# EAGLE design power (EAGLE 7.7.0)
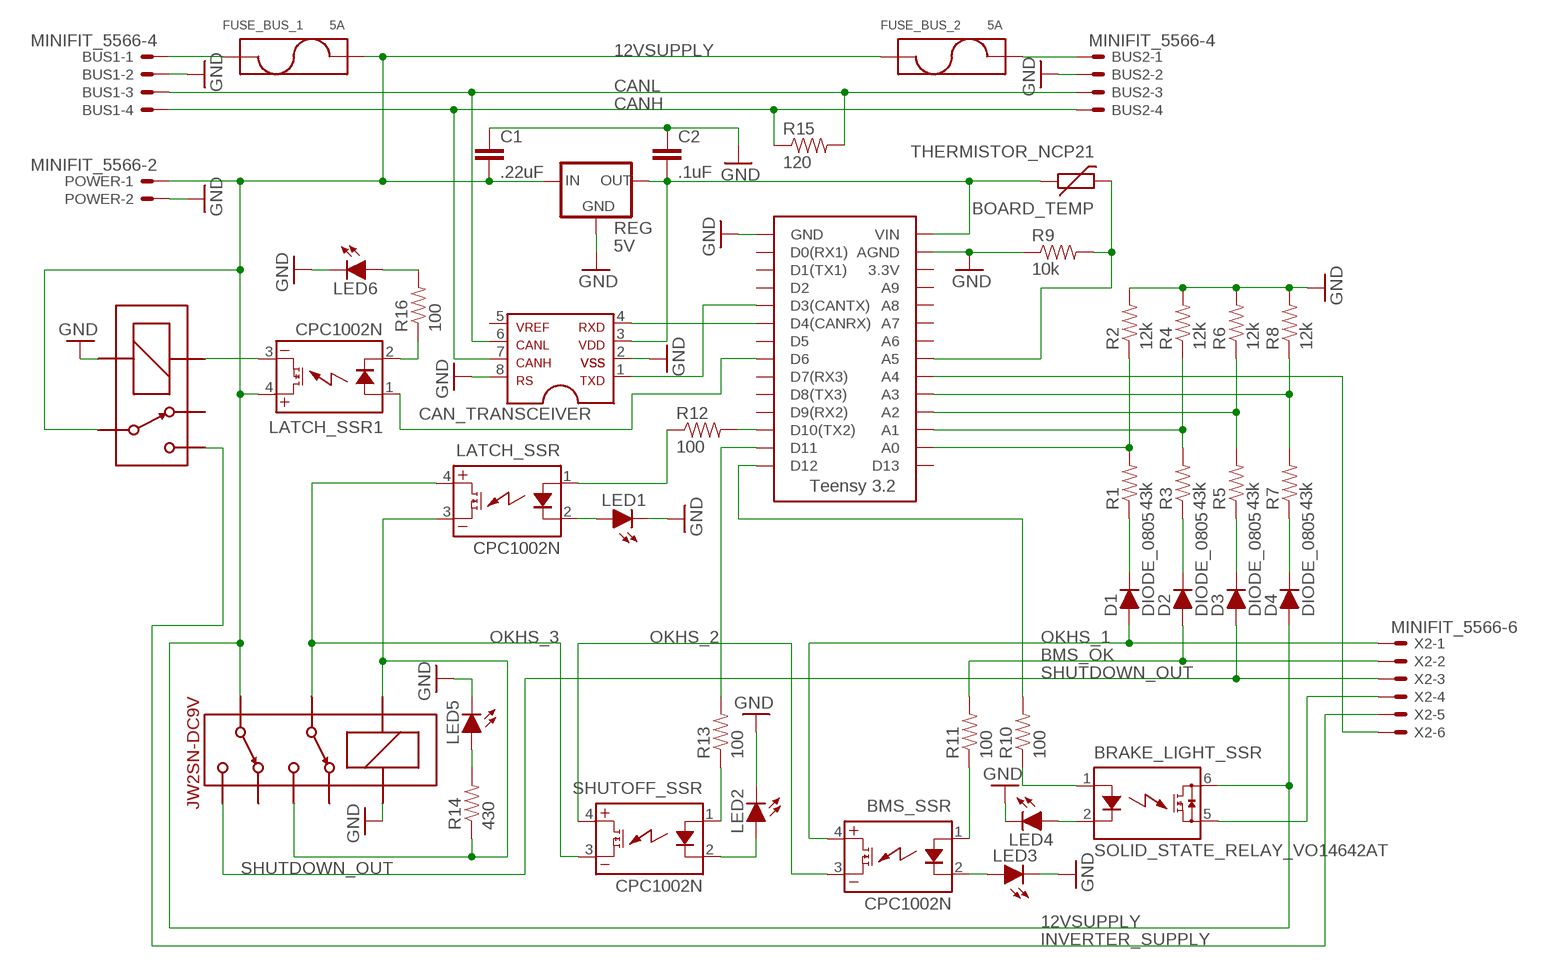
[diagram p0: schematic, sheet 1]

## Parts
BMS_SSR  CPC1002N  [SOP04]
BOARD_TEMP  THERMISTOR_NCP21  [0805]
BRAKE_LIGHT_SSR  SOLID_STATE_RELAY_VO14642AT  [DIL06]
BUS1  MINIFIT_5566-4  [MINIFIT_5566-4]
BUS2  MINIFIT_5566-4  [MINIFIT_5566-4]
C1  .22uF  CAP0805  [0805]
C2  .1uF  CAP0805  [0805]
CAN_TRANSCEIVER  MCP2551  [SOIC-08]
D1  DIODE_0805  [0805]
D2  DIODE_0805  [0805]
D3  DIODE_0805  [0805]
D4  DIODE_0805  [0805]
FUSE_BUS_1  5A  FUSE_HOLDER  [FUSE_HOLDER]
FUSE_BUS_2  5A  FUSE_HOLDER  [FUSE_HOLDER]
IMD_SHUTDOWN  DPDT_RELAY_PANASONIC_JW2SN-DC9V  [DPDT_RELAY_PANASONIC_JW2SN]
LATCH_SSR  CPC1002N  [SOP04]
LATCH_SSR1  CPC1002N  [SOP04]
LED1  LED-0805  [LED-805]
LED2  LED-0805  [LED-805]
LED3  LED-0805  [LED-805]
LED4  LED-0805  [LED-805]
LED5  LED-0805  [LED-805]
LED6  LED-0805  [LED-805]
POWER  MINIFIT_5566-2  [MINIFIT_5566-2]
R1  43k  RESISTOR0805-RES  [0805]
R2  12k  RESISTOR0805-RES  [0805]
R3  43k  RESISTOR0805-RES  [0805]
R4  12k  RESISTOR0805-RES  [0805]
R5  43k  RESISTOR0805-RES  [0805]
R6  12k  RESISTOR0805-RES  [0805]
R7  43k  RESISTOR0805-RES  [0805]
R8  12k  RESISTOR0805-RES  [0805]
R9  10k  RESISTOR0805-RES  [0805]
R10  100  RESISTOR0805-RES  [0805]
R11  100  RESISTOR0805-RES  [0805]
R12  100  RESISTOR0805-RES  [0805]
R13  100  RESISTOR0805-RES  [0805]
R14  430  RESISTOR0805-RES  [0805]
R15  120  RESISTOR0805-RES  [0805]
R16  100  RESISTOR0805-RES  [0805]
REG  5V  5V_REGULATOR_LM340-NLM340MPX-5.0/NOPB  [SOT223]
SHUTOFF_SSR  CPC1002N  [SOP04]
U$1  ORWH-SH-112D1F  [ZF112]
U$3  TEENSY_3.2_SIMPLE  [TEENSY_3.2_SIMPLE]
X2  MINIFIT_5566-6  [MINIFIT_5566-6]

## Nets
5VSUPPLY: BOARD_TEMP.1 C2.2 CAN_TRANSCEIVER.3 REG.3(OUT) U$3.VIN
12VSUPPLY: BRAKE_LIGHT_SSR.6(IO1) C1.2 D4.2(A) FUSE_BUS_1.R1 FUSE_BUS_1.R2 FUSE_BUS_2.L1 FUSE_BUS_2.L2 IMD_SHUTDOWN.6 LATCH_SSR1.4(DC+) POWER.1 REG.1(IN) U$1.P
12VSUPPLY_READ: R7.2 R8.1 U$3.A3
BMS_OK: D2.2(A) R11.2 X2.2
BMS_OK_READ: R3.2 R4.1 U$3.A1
CANH: BUS1.4 BUS2.4 CAN_TRANSCEIVER.7 R15.1
CANL: BUS1.3 BUS2.3 CAN_TRANSCEIVER.6 R15.2
GND: BUS1.2 BUS2.2 C1.1 C2.1 CAN_TRANSCEIVER.2 CAN_TRANSCEIVER.8 IMD_SHUTDOWN.COIL+ LED1.C LED2.C LED3.C LED4.C LED5.C LED6.C POWER.2 R2.2 R4.2 R6.2 R8.2 R9.1 REG.2(GND) REG.4(GND) U$1.2(COIL-) U$3.AGND U$3.GND
INVERTER_SUPPLY: U$1.S X2.5
N$1: LATCH_SSR.2(CONTROL-) LED1.A
N$2: CAN_TRANSCEIVER.4 U$3.D4(CANRX)
N$3: CAN_TRANSCEIVER.1 U$3.D3(CANTX)
N$4: BRAKE_LIGHT_SSR.5(IO2) X2.4
N$5: R12.2 U$3.D10(TX2)
N$6: IMD_SHUTDOWN.4 IMD_SHUTDOWN.COIL- LATCH_SSR.3(DC-) R14.1
N$7: BRAKE_LIGHT_SSR.2(LED-) LED4.A
N$8: LATCH_SSR.1(CONTROL+) R12.1
N$9: BMS_SSR.2(CONTROL-) LED3.A
N$10: BUS1.1 FUSE_BUS_1.L1 FUSE_BUS_1.L2
N$11: BUS2.1 FUSE_BUS_2.R1 FUSE_BUS_2.R2
N$12: R13.1 SHUTOFF_SSR.1(CONTROL+)
N$13: R10.2 U$3.D12
N$14: R13.2 U$3.D11
N$15: BOARD_TEMP.2 R9.2 U$3.A5
N$16: LED2.A SHUTOFF_SSR.2(CONTROL-)
N$17: BRAKE_LIGHT_SSR.1(LED+) R10.1
N$18: BMS_SSR.1(CONTROL+) R11.1
N$19: LED5.A R14.2
N$20: U$3.A4 X2.6
N$21: LATCH_SSR1.1(CONTROL+) U$3.D6
N$22: D1.1(C) R1.1
N$23: D2.1(C) R3.1
N$24: D3.1(C) R5.1
N$25: D4.1(C) R7.1
N$26: LATCH_SSR1.3(DC-) U$1.1(COIL+)
N$27: LATCH_SSR1.2(CONTROL-) R16.1
N$28: LED6.A R16.2
OKHS_1: BMS_SSR.4(DC+) D1.2(A) X2.1
OKHS_2: BMS_SSR.3(DC-) SHUTOFF_SSR.4(DC+)
OKHS_3: IMD_SHUTDOWN.3 LATCH_SSR.4(DC+) SHUTOFF_SSR.3(DC-)
OKHS_READ: R1.2 R2.1 U$3.A0
SHUTDOWN_OUT: D3.2(A) IMD_SHUTDOWN.5 X2.3
SHUTDOWN_OUT_READ: R5.2 R6.1 U$3.A2
Unconnected: CAN_TRANSCEIVER.5 IMD_SHUTDOWN.2 IMD_SHUTDOWN.7 U$1.O U$3.3.3V U$3.A6 U$3.A7 U$3.A8 U$3.A9 U$3.D0(RX1) U$3.D1(TX1) U$3.D2 U$3.D5 U$3.D7(RX3) U$3.D8(TX3) U$3.D9(RX2) U$3.D13

## Library data of the parts
BMS_SSR LATCH_SSR LATCH_SSR1 SHUTOFF_SSR = HyTechDevices:CPC1002N: IXYS Solid State Relay .7A
BOARD_TEMP = HyTechDevices:THERMISTOR_NCP21: Murata NCP21 10k Thermistor Datasheet <http://www.murata.com/~/media/webrenewal/support/library/catalog/products/thermistor/ntc/r44e.ashx>
BRAKE_LIGHT_SSR = HyTechDevices:SOLID_STATE_RELAY
BUS1 BUS2 = HyTechDevices:MINIFIT_5566-4: Mini-Fit Junior connector 4 pole Source: http://www.molex.com; OC_FARNELL: unknown; OC_NEWARK: unknown
C1 C2 = HyTechDevices:CAP: Capacitor Standard 0603 ceramic capacitor, and 0.1" leaded capacitor.
CAN_TRANSCEIVER = HyTechDevices:MCP2551: MCP2551 High-Speed CAN Transceiver Product Webpage <https://www.microchip.com/wwwproducts/en/MCP2551> Datasheet <http://ww1.microchip.com/downloads/en/DeviceDoc/21667f.pdf> This device is outdated It is replaced by MCP2561. Comparison Page <https://www.microchip.com/wwwproducts/ProductCompare/MCP2551/MCP2561> Product Webpage <https://www.microchip.com/wwwproducts/en/MCP2561> Datasheet <http://ww1.microchip.com/downloads/en/DeviceDoc/20005167C.pdf>
D1-D4 = HyTechDevices:DIODE: DIODE general purpose rectifier
FUSE_BUS_1 FUSE_BUS_2 = HyTechDevices:FUSE_HOLDER: Keystone Electronics 3568 Fuse Mouser Part <http://www.mouser.com/ProductDetail/Keystone-Electronics/3568> Datasheet <http://www.mouser.com/ds/2/215/568-742601.pdf>
IMD_SHUTDOWN = HyTechDevices:DPDT_RELAY_PANASONIC_JW2SN-DC9V: Double Pull Double Throw Relay 9VDC Datasheet <http://www.mouser.com/ds/2/316/jw-catalog-461998.pdf> Product Page <http://www.mouser.com/ProductDetail/Panasonic-Industrial-Devices/JW2SN-DC9V>
LED1-LED6 = HyTechDevices:LED: Light Emitting Diode (LED) Source: Dangerous Prototypes Eagle Library <https://github.com/DangerousPrototypes/Eagle_Part_Library>
POWER = HyTechDevices:MINIFIT_5566-2: Mini-Fit Junior connector 2 pole Source: http://www.molex.com; OC_FARNELL: 1822072; OC_NEWARK: unknown
R1-R16 = HyTechDevices:RESISTOR: Resistor Basic schematic elements and footprints for 0603, 1206, and PTH resistors.
REG = HyTechDevices:5V_REGULATOR_LM340-N: Voltage Regulator 5v linear voltage regulator Datasheet <http://www.mouser.com/ProductDetail/Texas-Instruments/LM340MPX-50-NOPB/?qs=X1J7HmVL2ZGZwtTFRQ9ItA%3D%3D> MAX current out: 1.5A MAX voltage in: 35V
U$1 = HyTechDevices:ORWH-SH-112D1F: TE SPST relay
U$3 = HyTechDevices:TEENSY_3.2_SIMPLE: Simple version of the Teensy 3.2 board that only uses the 2 main rows of pins, not the inner pins or the pins opposite the usb port.
X2 = HyTechDevices:MINIFIT_5566-6: Mini-Fit Junior connector 6 pole Source: http://www.molex.com; MPN: 95566-61002; OC_FARNELL: unknown; OC_NEWARK: 22K8620

## Board
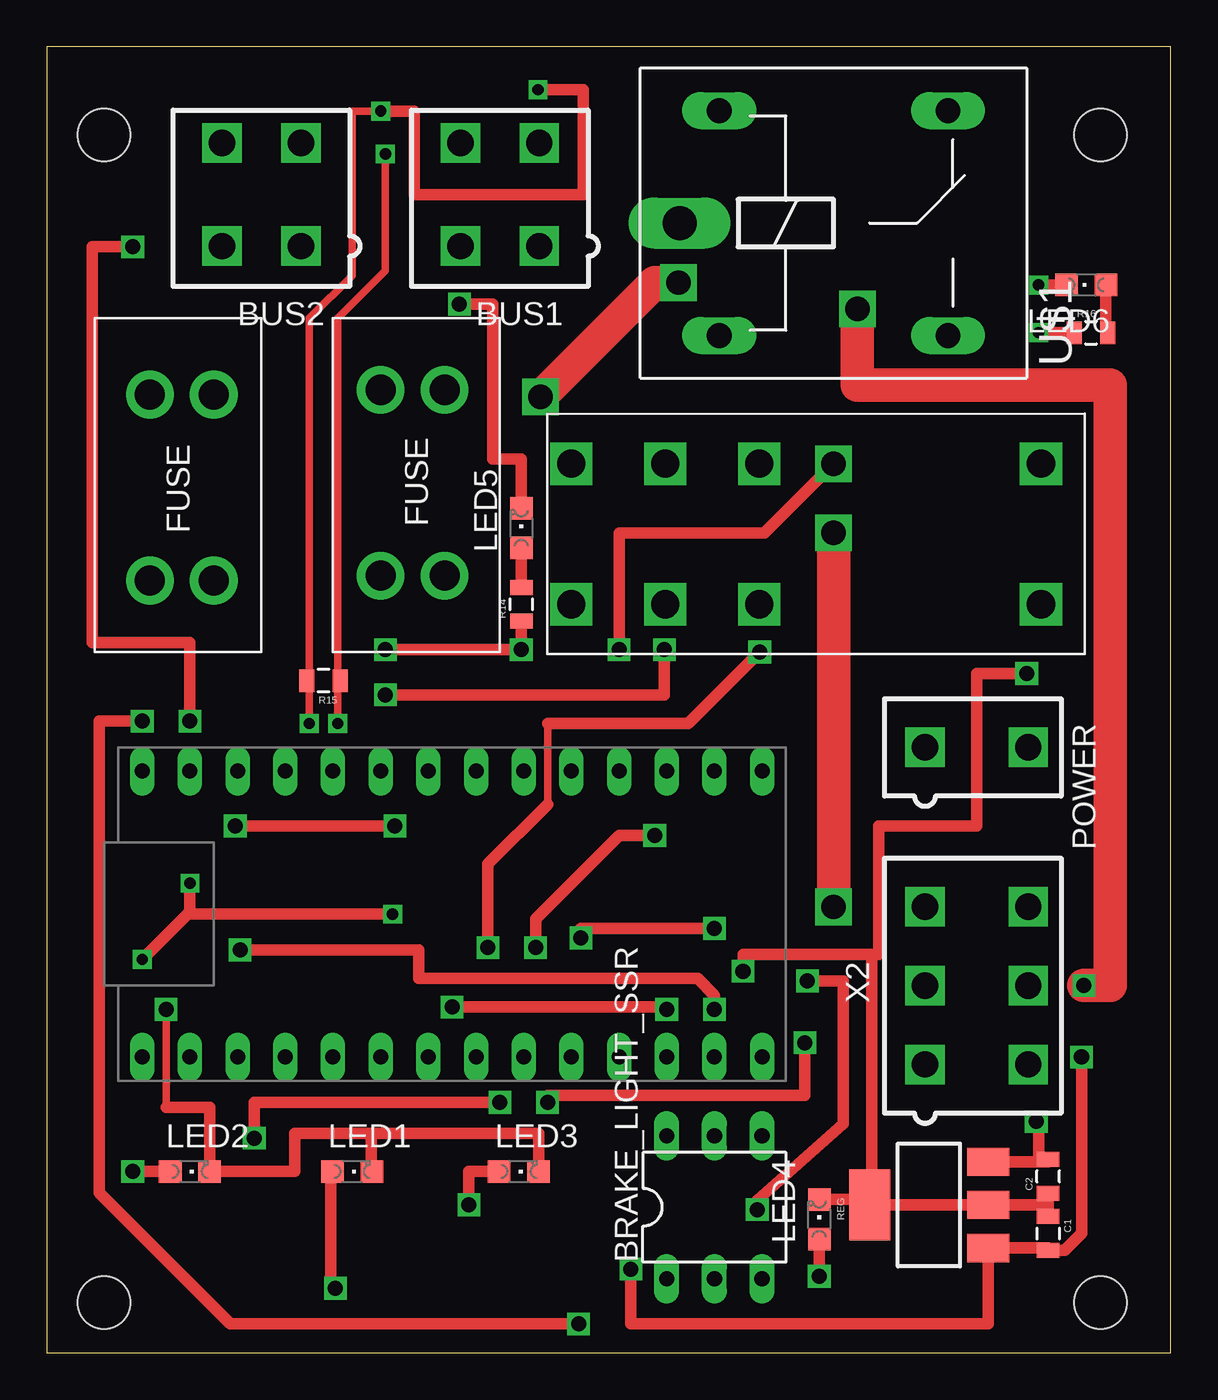
[diagram p1: board, top side]
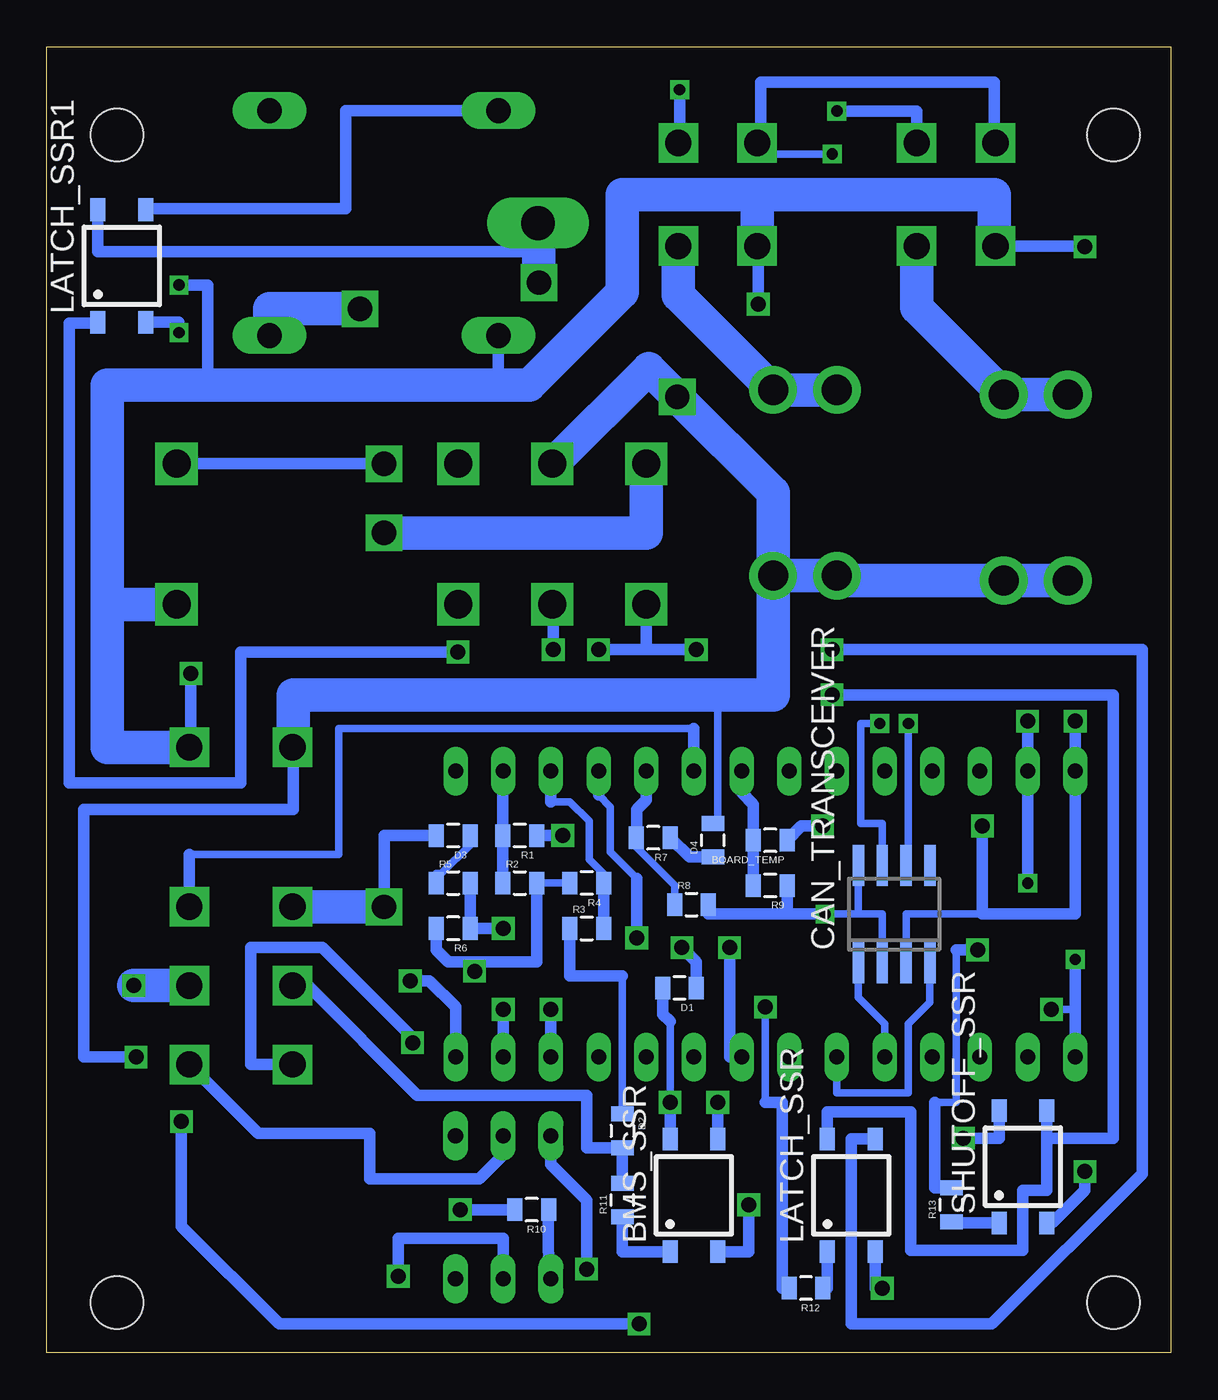
[diagram p2: board, bottom side, seen from below]

Size 59.87 x 69.59 mm. Coordinates in mm from the lower left corner, seen from the top.
Outline: 0,0 59.87,0 59.87,69.59 0,69.59 0,0
Copper layers (1*16): Top 0.035mm / dielectric 1.5mm / Bottom 0.035mm
Design rules "default": minimum track width 10mil, minimum drill 24mil, track to track 8mil, track to pad 8mil, pad to pad 8mil, via to via 8mil, smd to smd 8mil, copper to edge 40mil, drill to drill 8mil, minimum pad ring 10mil, minimum via ring 8mil, stop-mask expansion 4mil, vias tented up to drill 0mil, thermal gap 10mil
Holes 2.8 mm at 3.05,64.9 56.13,64.9 3.05,2.67 56.13,2.67

### Footprints (pad centres in the part's own frame; a part is rotated, then mirrored left to right if it is on the bottom)
SOP04 = smd 0.8 x 1.2: 1 -1.27,-3; 2 1.27,-3; 3 1.27,3; 4 -1.27,3
0805 = smd 0.8 x 1.2: 1 -0.9,0; 2 0.9,0
DIL06 = drill 0.813 long: 1 -2.54,-3.81; 2 0,-3.81; 3 2.54,-3.81; 4 2.54,3.81; 5 0,3.81; 6 -2.54,3.81
MINIFIT_5566-4 = drill 1.4 square: 1 2.1,-2.75; 2 -2.1,-2.75; 3 2.1,2.75; 4 -2.1,2.75
SOIC-08 = smd 0.6 x 2.2: 1 -1.905,-2.6; 2 -0.635,-2.6; 3 0.635,-2.6; 4 1.905,-2.6; 5 1.905,2.6; 6 0.635,2.6; 7 -0.635,2.6; 8 -1.905,2.6
FUSE_HOLDER = drill 1.6 pad 2.54: L1 0,3.404; L2 0,0; R1 9.906,3.404; R2 9.906,0
DPDT_RELAY_PANASONIC_JW2SN = drill 1.5 square: 2 10.008,0; 3 5.004,0; 4 0,0; 5 0,7.493; 6 5.004,7.493; 7 10.008,7.493; COIL+ 25.019,0; COIL- 25.019,7.493
LED-805 = smd 1.2 x 1.2: A 0,-1.05; C 0,1.05
MINIFIT_5566-2 = drill 1.4 square: 1 0,-2.75; 2 0,2.75
SOT223 = smd 1.5 x 2.235: 1 -2.3,-3.15; 2 0,-3.15; 3 2.3,-3.15 | smd 3.8 x 2.2: 4 0,3.15
ZF112 = drill 1.321 long: 1 4.064,14.884; 2 4.064,2.896; O 16.256,14.884; S 16.256,2.896 | drill 1.803 long: P 1.956,8.89
TEENSY_3.2_SIMPLE = drill 0.8 long: 3.3V 16.51,29.21; A0 16.51,3.81; A1 16.51,6.35; A2 16.51,8.89; A3 16.51,11.43; A4 16.51,13.97; A5 16.51,16.51; A6 16.51,19.05; A7 16.51,21.59; A8 16.51,24.13; A9 16.51,26.67; AGND 16.51,31.75; D0(RX1) 1.27,31.75; D1(TX1) 1.27,29.21; D2 1.27,26.67; D3(CANTX) 1.27,24.13; D4(CANRX) 1.27,21.59; D5 1.27,19.05; D6 1.27,16.51; D7(RX3) 1.27,13.97; D8(TX3) 1.27,11.43; D9(RX2) 1.27,8.89; D10(TX2) 1.27,6.35; D11 1.27,3.81; D12 1.27,1.27; D13 16.51,1.27; GND 1.27,34.29; VIN 16.51,34.29
MINIFIT_5566-6 = drill 1.4 square: 1 4.2,-2.75; 2 0,-2.75; 3 -4.2,-2.75; 4 4.2,2.75; 5 0,2.75; 6 -4.2,2.75

### Placement (x,y rotation side)
BMS_SSR  25.4,8.38 0 bottom
BOARD_TEMP  21.34,27.3 180 bottom
BRAKE_LIGHT_SSR  35.56,7.75 0 top
BUS1  24.13,61.72 0 top
BUS2  11.43,61.72 0 top
C1  53.34,6.35 270 top
C2  53.34,9.4 90 top
CAN_TRANSCEIVER  14.73,23.37 0 bottom
D1  26.16,19.43 180 bottom
D2  29.21,11.81 270 bottom
D3  38.23,27.56 180 bottom
D4  24.38,27.3 90 bottom
FUSE_BUS_1  17.78,51.31 270 top
FUSE_BUS_2  8.89,41.15 90 top
IMD_SHUTDOWN  27.94,39.88 0 top
LATCH_SSR  17.02,8.38 0 bottom
LATCH_SSR1  55.88,57.91 0 bottom
LED1  16.26,9.65 270 top
LED2  7.62,9.65 270 top
LED3  25.15,9.65 270 top
LED4  41.15,7.11 0 top
LED5  25.27,43.94 0 top
LED6  55.37,56.9 90 top
POWER  49.53,32.26 270 top
R1  34.67,27.56 180 bottom
R2  34.67,25.02 0 bottom
R3  31.11,22.61 0 bottom
R4  31.11,25.02 180 bottom
R5  38.23,25.02 0 bottom
R6  38.23,22.61 180 bottom
R7  27.56,27.43 180 bottom
R8  25.53,23.88 0 bottom
R9  21.34,24.89 180 bottom
R10  34.04,7.62 180 bottom
R11  29.21,8.13 90 bottom
R12  19.43,3.43 180 bottom
R13  11.68,7.87 90 bottom
R14  25.27,39.88 90 top
R15  14.73,35.81 180 top
R16  55.63,54.36 0 top
REG  46.99,7.87 90 top
SHUTOFF_SSR  7.87,9.91 0 bottom
U$1  31.75,51.31 0 top
U$3  39.37,14.48 90 top
X2  49.53,19.56 270 top

### Tracks (layer width: path | path; a pad name or v marks a point on that pad's centre or on a via)
5VSUPPLY  (via drill 0.8)
  Top 0.61: v18.54,28.07 v10.03,28.07 | v5.08,33.66 2.79,33.66 2.79,8.51 9.78,1.52 v28.32,1.52 | REG.3 52.83,10.17 | 52.83,10.17 53.34,10.17 C2.2 | v52.7,12.32 52.83,12.32 52.83,10.17
  Bottom 0.406: 10.03,23.37 14.1,23.37 CAN_TRANSCEIVER.3
  Bottom 0.61: v10.03,28.07 10.03,23.37 5.08,23.37 U$3.VIN v5.08,33.66 | v28.32,1.52 47.5,1.52 52.7,6.73 v52.7,12.32 | v18.54,28.07 19.67,28.07 BOARD_TEMP.1
12VSUPPLY  (via drill 0.8, 1.3)
  Top 0.61: v31.11,4.45 31.11,1.52 50.14,1.52 REG.1 53.34,5.57 C1.2 54.22,5.45 55.12,6.35 v55.12,15.75
  Top 1.778: v26.29,50.93 32.38,57.02 v33.66,57.02
  Bottom 0.406: 24.13,35.05 24.13,28.46 D4.2
  Bottom 0.61: LATCH_SSR1.4 57.15,58.67 33.71,58.67 U$1.P | BRAKE_LIGHT_SSR.6 33.02,10.03 31.11,8.13 v31.11,4.45 | 46.74,32.26 46.74,28.96 57.91,28.96 57.91,15.75 v55.12,15.75
  Bottom 1.016: 17.78,41.15 FUSE_BUS_1.R2 | POWER.1 46.74,32.26
  Bottom 1.778: FUSE_BUS_2.L1 FUSE_BUS_2.L2 17.78,41.15 | FUSE_BUS_1.R2 FUSE_BUS_1.R1 | 46.74,32.26 46.74,35.05 24.13,35.05 21.18,35.05 FUSE_BUS_1.R1 | FUSE_BUS_1.R1 21.18,45.82 v26.29,50.93 27.81,52.45 32.89,47.37 IMD_SHUTDOWN.6 | v33.66,57.02 33.66,60.15 U$1.P
12VSUPPLY_READ
  Bottom 0.406: 26.42,23.89 26.42,24.89 28.45,26.92 28.45,27.42 R7.2
  Bottom 0.61: U$3.A3 27.95,30.99 27.95,29.45 28.45,28.96 28.45,27.44 R7.2 | 26.42,23.89 R8.1
BMS_OK
  Bottom 0.61: R11.2 D2.2 29.21,10.92 31.11,10.92 31.11,13.72 40.13,13.72 45.97,19.56 X2.2
BMS_OK_READ
  Bottom 0.406: R4.1 30.23,25.02 30.23,25.53 30.99,26.29 30.99,28.32 32,29.34 33.02,29.34
  Bottom 0.61: R3.2 R4.1 | 33.02,29.34 U$3.A1
CANH  (via drill 0.6)
  Top 0.406: v18.03,63.88 18.03,57.66 15.49,55.12 15.49,35.81 | 15.49,35.81 v15.49,33.53 | R15.1 15.49,35.81
  Bottom 0.406: v15.49,33.53 16.51,33.53 16.51,28.19 15.37,28.19 CAN_TRANSCEIVER.7 | v18.03,63.88 21.44,63.88 BUS1.4
  Bottom 0.61: BUS1.4 21.84,64.47 21.84,67.69 9.4,67.69 9.4,64.47 BUS2.4
CANL  (via drill 0.6)
  Top 0.406: v13.97,33.53 13.97,35.81 | 13.97,35.81 13.97,55.12 16.26,57.4 16.26,66.17 v17.78,66.17 | R15.2 13.97,35.81
  Top 0.61: v26.16,67.31 28.57,67.31 28.57,61.72 19.56,61.72 19.56,66.17 v17.78,66.17
  Bottom 0.406: CAN_TRANSCEIVER.6 13.97,25.97 v13.97,33.53
  Bottom 0.61: BUS1.3 26.16,64.47 v26.16,67.31 | 13.53,64.52 BUS2.3 13.53,66.17 v17.78,66.17
GND  (via drill 0.6, 0.8)
  Top 0.406: 6.35,13.08 v6.35,18.29
  Top 0.61: LED6.C v52.83,56.9 | C2.1 53.34,7.87 | 53.34,7.87 C1.1 | 7.62,23.37 7.49,23.37 v5.08,20.95 | 53.34,7.87 REG.2 REG.4 43.84,8.16 | LED3.C 26.2,11.68 17.27,11.68 17.27,11.56 | 17.27,11.56 17.27,9.91 LED1.C | 17.27,11.56 17.14,11.68 13.21,11.68 13.21,9.65 LED2.C 8.67,13.08 6.35,13.08 | LED5.C 25.27,47.62 23.75,47.62 23.75,55.88 v21.97,55.88 | 43.84,8.16 43.94,8.16 43.94,21.21 | 43.84,8.16 LED4.C | 43.94,21.21 37.08,21.21 v37.08,20.32 | v52.2,36.2 49.53,36.2 49.53,28.07 44.32,28.07 44.32,21.21 43.94,21.21 | v7.62,33.66 7.62,37.85 2.41,37.85 2.41,58.93 v4.57,58.93 | 7.62,23.37 v7.62,25.02 | v18.41,23.37 7.62,23.37
  Bottom 0.406: CAN_TRANSCEIVER.2 15.37,23.37 16.64,23.37 | 16.64,23.37 CAN_TRANSCEIVER.8 | v18.41,23.37 16.64,23.37 | R2.2 R4.2 | v6.35,18.29 5.08,18.29 5.08,17.78
  Bottom 0.61: v52.83,56.9 51.31,56.9 51.31,51.56 | v5.08,20.95 5.08,17.78 U$3.GND | U$1.2 35.81,51.82 35.56,51.56 | v21.97,55.88 21.97,58.97 BUS1.2 | POWER.2 52.2,32.26 v52.2,36.2 | v7.62,33.66 U$3.AGND v7.62,25.02 | v4.57,58.93 4.57,58.97 BUS2.2 | v18.41,23.37 20.44,23.37 | 20.44,23.37 R9.1 | R2.2 33.77,20.83 37.08,20.83 | 20.44,23.37 24.63,23.37 R8.2 | 37.08,20.83 v37.08,20.32 | 37.08,20.83 38.48,20.83 39.12,21.46 39.12,22.59 R6.2
  Bottom 1.778: POWER.2 56.64,32.26 56.64,39.88 | 56.64,39.88 56.64,51.56 51.31,51.56 35.56,51.56 34.16,51.56 29.21,56.52 29.21,61.72 22.03,61.72 | IMD_SHUTDOWN.COIL+ 56.64,39.88 | BUS2.2 9.4,58.97 9.4,61.72 22.03,61.72 | 22.03,61.72 BUS1.2
INVERTER_SUPPLY  (via drill 0.8, 1.3)
  Top 1.778: 56.64,19.56 56.64,19.68 | 56.64,19.68 56.64,51.56 43.18,51.56 v43.18,55.63 | v55.24,19.56 56.52,19.56 56.64,19.68
  Bottom 1.778: v43.18,55.63 48.01,55.63 U$1.S | X2.5 v55.24,19.56
N$1  (via drill 0.8)
  Top 0.61: 15.24,9.91 LED1.A 15.11,9.91 15.11,3.43 v15.37,3.43
  Bottom 0.61: LATCH_SSR.2 15.75,3.43 v15.37,3.43
N$2
  Bottom 0.406: CAN_TRANSCEIVER.4 12.83,18.67 13.97,17.53 13.97,13.84 17.78,13.84 U$3.D4(CANRX)
N$3
  Bottom 0.406: U$3.D3(CANTX) 15.24,17.53 16.64,18.92 CAN_TRANSCEIVER.1
N$4
  Bottom 0.61: BRAKE_LIGHT_SSR.5 35.56,10.54 36.83,9.27 42.67,9.27 42.67,11.68 48.61,11.68 X2.4
N$5  (via drill 0.8)
  Top 0.406: 33.02,18.41 v33.02,18.29
  Top 0.61: v21.59,18.41 33.02,18.41
  Bottom 0.406: 21.59,13.34 v21.59,18.41
  Bottom 0.61: R12.2 20.7,3.43 20.7,13.34 21.59,13.34 | v33.02,18.29 U$3.D10(TX2)
N$6  (via drill 0.8, 1.3)
  Top 0.61: v41.91,47.37 38.23,43.69 30.48,43.69 v30.48,37.47 | R14.1 v25.27,37.47 v18.03,37.47
  Bottom 0.61: IMD_SHUTDOWN.COIL- v41.91,47.37 | IMD_SHUTDOWN.4 27.94,37.59 | 27.94,37.59 27.94,37.47 v25.27,37.47 | v18.03,37.47 1.52,37.47 1.52,9.53 9.53,1.52 17.02,1.52 17.02,11.38 LATCH_SSR.3 | v30.48,37.47 28.07,37.47 27.94,37.59
N$7  (via drill 0.8)
  Top 0.61: v41.15,4.06 LED4.A
  Bottom 0.61: BRAKE_LIGHT_SSR.2 35.56,6.1 41.15,6.1 v41.15,4.06
N$8
  Bottom 0.61: LATCH_SSR.1 18.29,3.44 R12.1
N$9  (via drill 0.8)
  Top 0.61: v22.48,7.87 22.48,9.65 LED3.A
  Bottom 0.61: BMS_SSR.2 22.48,5.38 v22.48,7.87
N$10
  Bottom 1.778: FUSE_BUS_1.L2 FUSE_BUS_1.L1 26.23,56.35 BUS1.1
N$11
  Bottom 1.778: FUSE_BUS_2.R1 FUSE_BUS_2.R2 13.53,55.69 BUS2.1
N$12
  Bottom 0.61: SHUTOFF_SSR.1 11.68,6.91 R13.1
N$13  (via drill 0.8)
  Top 0.61: v37.85,7.62 37.85,8.13 42.42,12.19 42.42,19.81 v40.51,19.81
  Bottom 0.61: R10.2 v37.85,7.62 | v40.51,19.81 39.5,19.81 38.1,18.41 U$3.D12
N$14  (via drill 0.8)
  Top 0.61: v35.56,18.29 35.56,19.05 34.67,19.94 19.81,19.94 19.81,21.46 v10.29,21.46
  Bottom 0.406: 12.57,13.34 11.43,13.34 11.43,21.46
  Bottom 0.61: R13.2 12.57,8.77 12.57,13.34 | 11.43,21.46 v10.29,21.46 | v35.56,18.29 U$3.D11
N$15
  Bottom 0.61: R9.2 BOARD_TEMP.2 22.24,29.22 22.86,29.84 U$3.A5
N$16  (via drill 0.8)
  Top 0.61: v4.57,9.65 LED2.A
  Bottom 0.61: SHUTOFF_SSR.2 6.3,6.91 4.57,8.64 v4.57,9.65
N$17
  Bottom 0.61: BRAKE_LIGHT_SSR.1 33.14,4.06 33.14,5.07 33.15,5.59 33.15,6.97 R10.1
N$18
  Bottom 0.61: BMS_SSR.1 29.21,5.38 R11.1
N$19
  Top 0.61: LED5.A R14.2
N$20
  Bottom 0.406: 25.4,33.27 44.32,33.27 44.32,26.54 52.28,26.54
  Bottom 0.61: U$3.A4 25.4,33.27 | 52.28,26.54 X2.6
N$21  (via drill 0.8)
  Top 0.406: 26.67,29.21 26.67,33.53
  Top 0.61: v23.5,21.59 23.5,26.04 26.67,29.21 | 26.67,33.53 34.16,33.53 v37.97,37.34
  Bottom 0.61: U$3.D6 23.5,15.75 v23.5,21.59 | v37.97,37.34 49.53,37.34 49.53,30.35 58.67,30.35 58.67,54.86 57.15,54.86 LATCH_SSR1.1
N$22  (via drill 0.8)
  Top 0.61: v26.04,21.59 26.04,23.11 30.48,27.56 v32.38,27.56
  Bottom 0.61: v32.38,27.56 R1.1 | D1.1 25.26,20.82 v26.04,21.59
N$23
  Bottom 0.406: D2.1 29.21,20.07
  Bottom 0.61: R3.1 32.02,20.07 29.21,20.07
N$24
  Bottom 0.406: D3.1 37.33,27.06 38.86,25.53 39.13,25.53 R5.1
N$25
  Bottom 0.61: D4.1 25.63,26.41 R7.1
N$26
  Bottom 0.61: U$1.1 43.94,66.19 43.94,60.96 54.31,60.96 LATCH_SSR1.3
N$27  (via drill 0.6)
  Top 0.61: v52.83,54.36 R16.1
  Bottom 0.61: LATCH_SSR1.2 52.83,54.91 v52.83,54.36
N$28
  Top 0.61: R16.2 56.42,54.1 LED6.A
OKHS_1  (via drill 0.8)
  Top 0.61: v26.67,13.34 26.67,13.72 40.39,13.72 v40.39,16.51
  Bottom 0.406: v26.67,13.34 26.67,17.65 | D1.2
  Bottom 0.61: v26.67,13.34 BMS_SSR.4 | X2.1 49.02,15.36 49.02,21.59 45.21,21.59 40.39,16.76 v40.39,16.51 | 26.67,17.65 27.05,18.03 D1.2
OKHS_2  (via drill 0.8)
  Top 0.61: v24.13,13.34 11.05,13.34 v11.05,11.43
  Bottom 0.61: BMS_SSR.3 v24.13,13.34 | v11.05,11.43 9.14,11.43 SHUTOFF_SSR.4
OKHS_3  (via drill 0.8)
  Top 0.61: v32.89,37.47 32.89,35.05 v18.03,35.05
  Bottom 0.61: LATCH_SSR.4 18.29,12.83 13.84,12.83 13.84,5.46 7.87,5.46 7.87,8.64 6.6,8.64 SHUTOFF_SSR.3 6.6,11.43 3.05,11.43 3.05,35.05 v18.03,35.05 | IMD_SHUTDOWN.3 32.89,39.88 v32.89,37.47
OKHS_READ
  Bottom 0.61: U$3.A0 R1.2 R2.1
SHUTDOWN_OUT  (via drill 1.3)
  Top 1.778: v41.91,43.69 v41.91,23.75
  Bottom 0.61: D3.2 41.91,27.56 v41.91,23.76
  Bottom 1.778: IMD_SHUTDOWN.5 27.94,43.69 v41.91,43.69 | v41.91,23.75 v41.91,23.76 X2.3
SHUTDOWN_OUT_READ  (via drill 0.8)
  Top 0.61: v35.56,22.61 28.45,22.61 v28.45,22.1
  Bottom 0.406: 28.45,25.27 29.84,26.67 29.84,29.08 30.48,29.72
  Bottom 0.61: R5.2 R6.1 v35.56,22.61 | 28.45,25.27 v28.45,22.1 | 30.48,29.72 U$3.A2